# Altium project Imu.PrjPcb
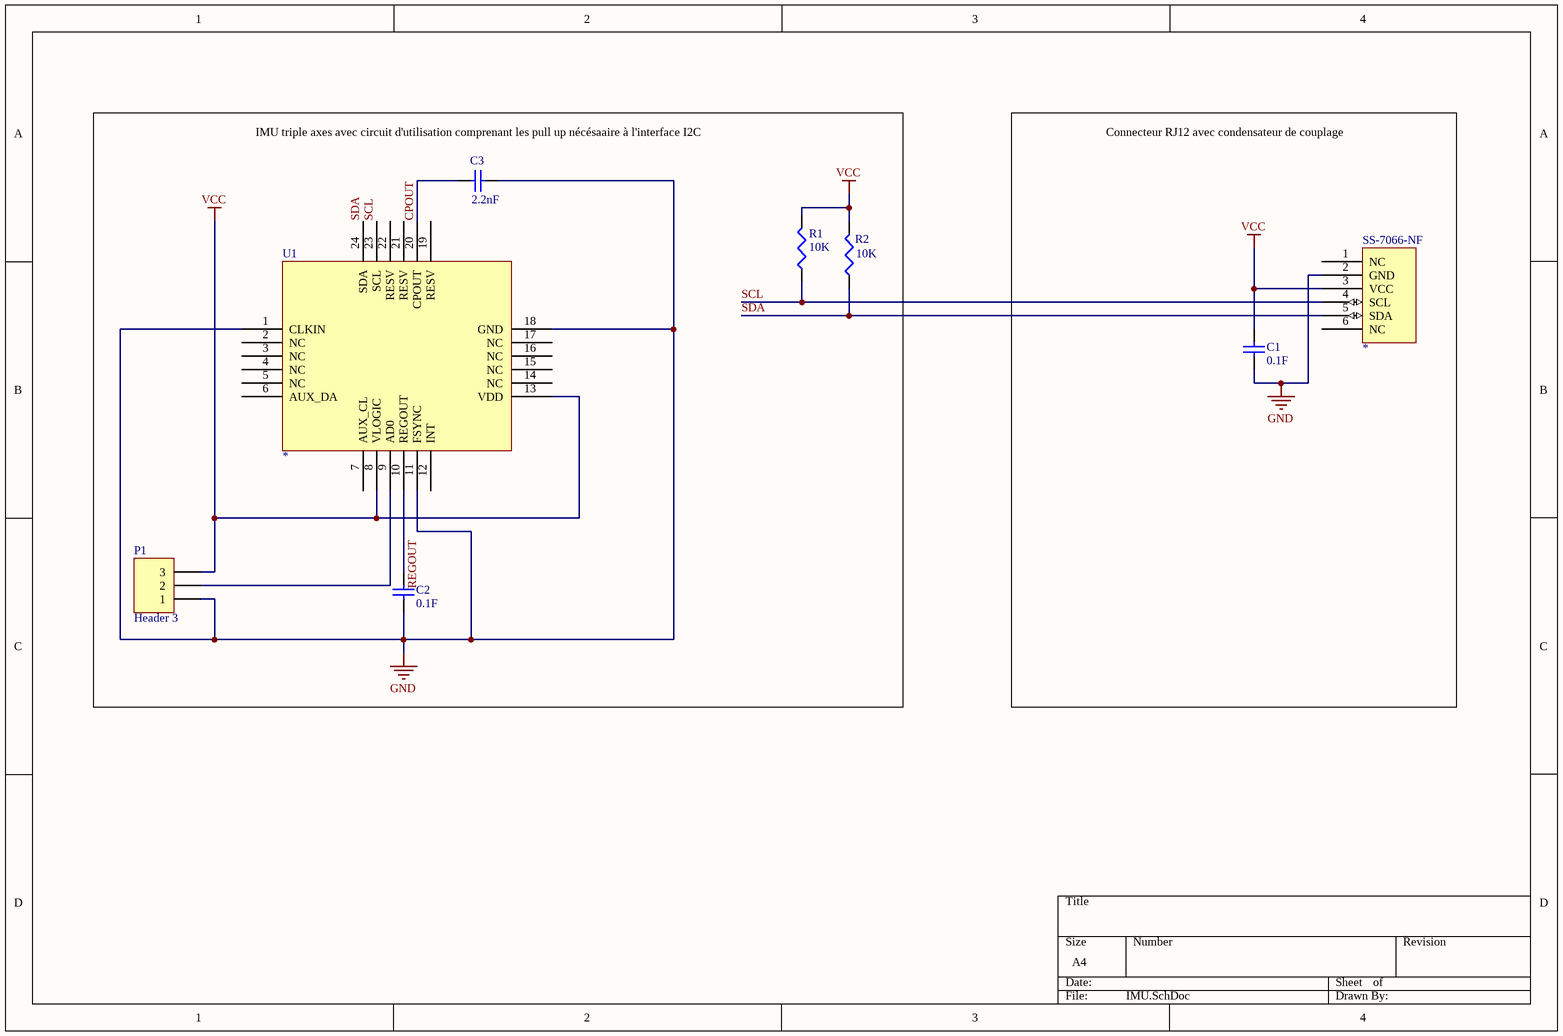
[diagram p0: IMU.SchDoc]
1 sheet, 8 parts. Net scope: global (net labels, ports and power ports of the same name join across sheets).
Board file: Imu.PcbDoc

## Sheet IMU.SchDoc
size A4

### Parts
C1  value 0.1F  [C0805]  (hidden comment: Cap 0.1uF)
C2  value 0.1F  [C0805]  (hidden comment: Cap 0.1uF)
C3  value 2.2nF  [C0805]  (hidden comment: Cap 2.2nF)
P1  Header 3  [HDR1X3]
R1  value 10K  [6-0805_N]  (hidden comment: Res 10K)
R2  value 10K  [6-0805_N]  (hidden comment: Res 10K)
SS-7066-NF  *  [SS-7066-NF]
U1  *  [MPU6050]

### Blocks framed on the sheet
Connecteur RJ12 avec condensateur de couplage: C1 SS-7066-NF

### Nets
GND: C1.1 C2.1 C3.2 P1.1 SS-7066-NF.2(GND) U1.1(CLKIN) U1.11(FSYNC) U1.18(GND)
VCC: C1.2 P1.3 R1.2 R2.2 SS-7066-NF.3(VCC) U1.8(VLOGIC) U1.13(VDD)
CPOUT: C3.1 U1.20(CPOUT)
REGOUT: C2.2 U1.10(REGOUT)
SCL: R1.1 SS-7066-NF.4(SCL) U1.23(SCL)
SDA: R2.1 SS-7066-NF.5(SDA) U1.24(SDA)
NetP1_2: P1.2 U1.9(AD0)

Not connected (* = marked no-connect by the designer): SS-7066-NF 1(NC) 6(NC); U1 2(NC) 3(NC) 4(NC) 5(NC) 6(AUX_DA) 7(AUX_CL) 12(INT) 14(NC) 15(NC) 16(NC) 17(NC) 19(RESV) 21(RESV) 22(RESV)

### Notes on the sheet
- (near C3) IMU triple axes avec circuit d'utilisation comprenant les pull up nécésaaire à l'interface I2C

### Library data of the parts
C1 C2 = Cap 0.1uF: Capacitor 0.1uF; Published: 8-Jun-2000; LatestRevisionDate: 29-May-2009; LatestRevisionNote: IPC-7351 Footprint Added.; PackageReference: C1206; Publisher: Altium Limited; PackageDescription: Chip Capacitor; Supplier 1: Digi-Key; Supplier Part Number 1: 478-1395-1-ND
C3 = Cap 2.2nF: Capacitor 2.2nF; Published: 8-Jun-2000; LatestRevisionDate: 29-May-2009; LatestRevisionNote: IPC-7351 Footprint Added.; PackageReference: C1206; Publisher: Altium Limited; PackageDescription: Chip Capacitor; Supplier 1: Digi-Key; Supplier Part Number 1: 1276-1171-1-ND
P1 = Header 3: Header, 3-Pin; LatestRevisionDate: 17-Jul-2002; LatestRevisionNote: Re-released for DXP Platform.; Publisher: Altium Limited; Supplier 1: Digi-Key; Supplier Part Number 1: WM11221-ND
R1 R2 = Res 10K: Resistor 10K; Published: 8-Jun-2000; LatestRevisionDate: 29-May-2009; LatestRevisionNote: IPC-7351 Footprint Added.; PackageReference: J1-0603; Publisher: Altium Limited; PackageDescription: Chip Resistor; Supplier 1: Digi-Key; Supplier Part Number 1: 311-10.0KCRCT-ND
SS-7066-NF = SS-7066-NF: RJ12 Connector; Supplier 1: Digi-Key; Supplier Part Number 1: 380-1043-ND
U1 = MPU6050: 3 Axis IMU; Supplier 1: Digi-Key; Supplier Part Number 1: 1428-1007-1-ND